# Altium schematic sheet NMT_I2C_INT.SCHDOC
size A4; Organization: Altium Limited; Address1: L3, 12a Rodborough Rd; Address2: Frenchs Forest; Address3: NSW; Address4: Australia 2086; DocumentNumber: 11; SheetNumber: 3; SheetTotal: 13
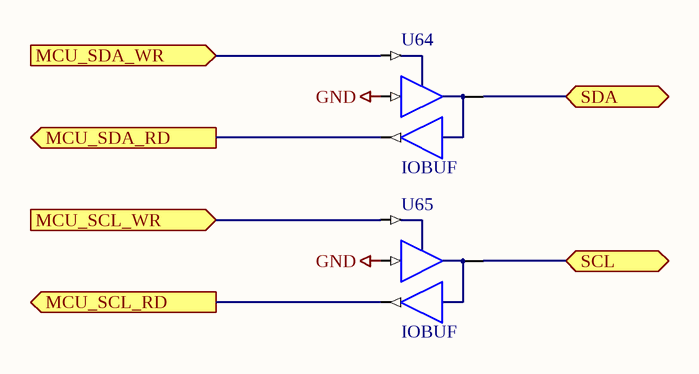
[diagram p0: NMT_I2C_INT.SCHDOC]

## Parts
U64  IOBUF
U65  IOBUF

## Ports
MCU_SCL_RD (out), MCU_SCL_WR (in), MCU_SDA_RD (out), MCU_SDA_WR (in), SCL (bidir), SDA (bidir)

## Nets
GND: U64.I U65.I
MCU_SCL_RD: U65.O ; port MCU_SCL_RD
MCU_SCL_WR: U65.T ; port MCU_SCL_WR
MCU_SDA_RD: U64.O ; port MCU_SDA_RD
MCU_SDA_WR: U64.T ; port MCU_SDA_WR
SCL: U65.IO ; port SCL
SDA: U64.IO ; port SDA

## Notes on the sheet
- Title
- Size:
- Date:
- A4
- Number:
- Time:
- Revision:
- Sheet
- of
- File:

## Library data of the parts
U64 U65 = IOBUF: Input/Output Buffer; ArchiveName: GENERIC; Published: 7-Nov-2003; Publisher: Altium Limited; Xilinx Equivalent: IOBUF; Core Revision: 1.00.00